# EAGLE design polarization_switch_mid_redo_top_rt (EAGLE 9.6.2)
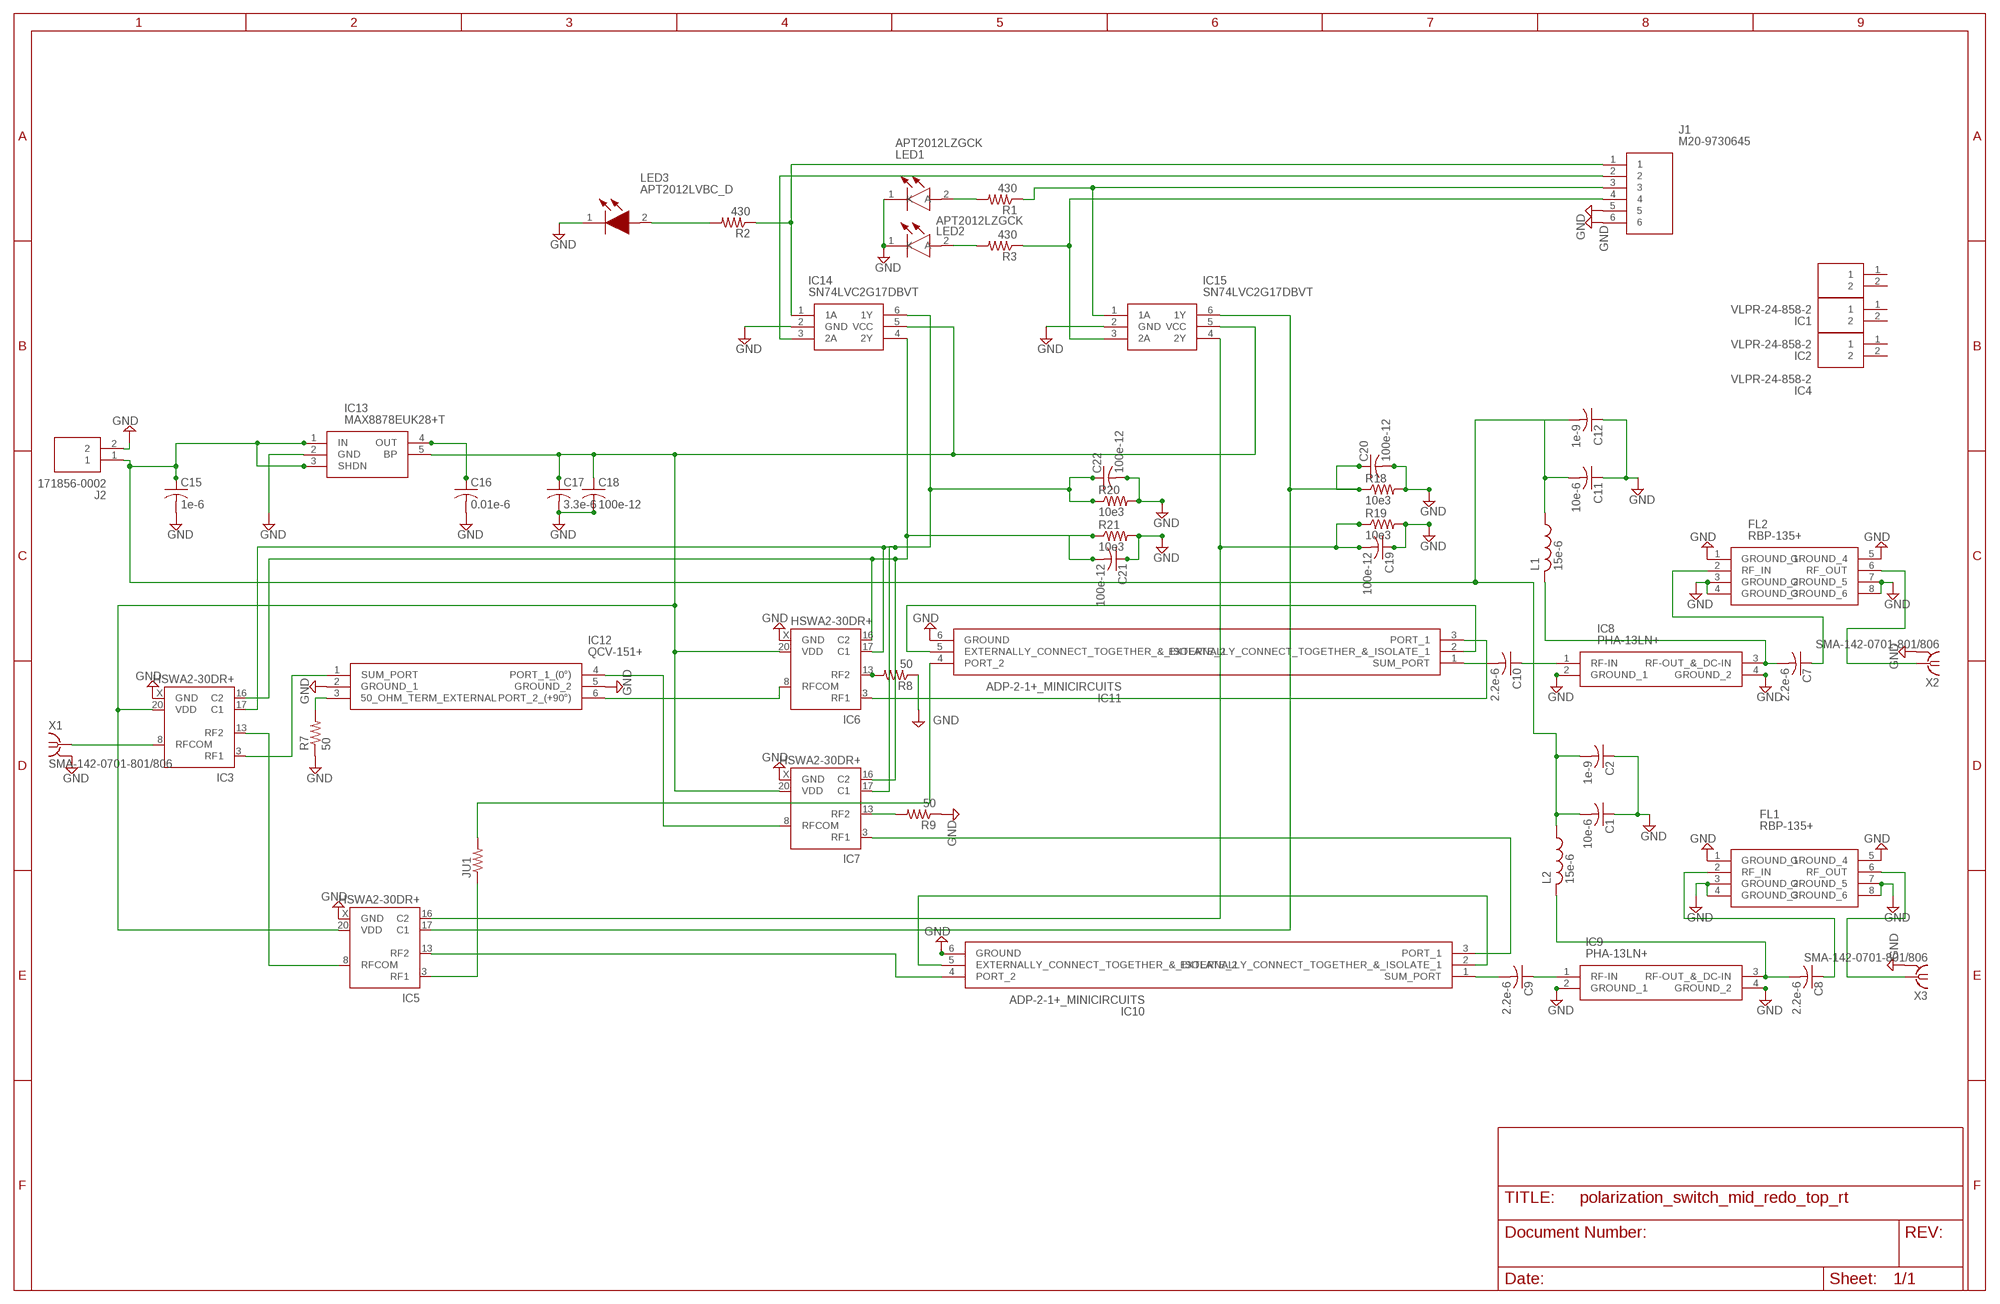
[diagram p0: schematic, sheet 1]

## Parts
C1  10e-6  C-USC0603  [C0603]
C2  1e-9  C-USC0603  [C0603]
C7  2.2e-6  C-USC0603  [C0603]
C8  2.2e-6  C-USC0603  [C0603]
C9  2.2e-6  C-USC0603  [C0603]
C10  2.2e-6  C-USC0603  [C0603]
C11  10e-6  C-USC0603  [C0603]
C12  1e-9  C-USC0603  [C0603]
C15  1e-6  C-USC0603  [C0603]
C16  0.01e-6  C-USC0603  [C0603]
C17  3.3e-6  C-USC0603  [C0603]
C18  100e-12  C-USC0603  [C0603]
C19  100e-12  C-USC0603  [C0603]
C20  100e-12  C-USC0603  [C0603]
C21  100e-12  C-USC0603  [C0603]
C22  100e-12  C-USC0603  [C0603]
FL1  RBP-135+  [RBP135]
FL2  RBP-135+  [RBP135]
IC1  VLPR-24-858-2  [VLPR248582]
IC2  VLPR-24-858-2  [VLPR248582]
IC3  HSWA2-30DR+  [DG983-1]
IC4  VLPR-24-858-2  [VLPR248582]
IC5  HSWA2-30DR+  [DG983-1]
IC6  HSWA2-30DR+  [DG983-1]
IC7  HSWA2-30DR+  [DG983-1]
IC8  PHA-13LN+  [PHA13LN]
IC9  PHA-13LN+  [PHA13LN]
IC10  ADP-2-1+_MINICIRCUITS  [SOTFL254P691X411-6N]
IC11  ADP-2-1+_MINICIRCUITS  [SOTFL254P691X411-6N]
IC12  QCV-151+  [QCV151]
IC13  MAX8878EUK28+T  [SOT95P280X145-5N]
IC14  SN74LVC2G17DBVT  [SOT95P280X145-6N]
IC15  SN74LVC2G17DBVT  [SOT95P280X145-6N]
J1  M20-9730645  [HDRV6W66P0X254_1X6_1524X254X96]
J2  171856-0002  [SHDR2W90P0X254_1X2_493X635X106]
JU1  R-US_R1206  [R1206]
L1  15e-6  L-USL3225M  [L3225M]
L2  15e-6  L-USL3225M  [L3225M]
LED1  APT2012LZGCK  [LEDC2012X85N]
LED2  APT2012LZGCK  [LEDC2012X85N]
LED3  APT2012LVBC_D  [LEDC2012X85N]
R1  430  R-US_R0603  [R0603]
R2  430  R-US_R0603  [R0603]
R3  430  R-US_R0603  [R0603]
R7  50  R-US_R0603  [R0603]
R8  50  R-US_R0603  [R0603]
R9  50  R-US_R0603  [R0603]
R18  10e3  R-US_R0603  [R0603]
R19  10e3  R-US_R0603  [R0603]
R20  10e3  R-US_R0603  [R0603]
R21  10e3  R-US_R0603  [R0603]
X1  SMA-142-0701-801/806  [J502-ND-142-0701-801/806]
X2  SMA-142-0701-801/806  [J502-ND-142-0701-801/806]
X3  SMA-142-0701-801/806  [J502-ND-142-0701-801/806]

## Nets
GND: C1.1 C2.1 C11.1 C12.1 C15.2 C16.2 C17.2 C18.2 C19.1 C20.2 C21.1 C22.2 FL1.1(GROUND_1) FL1.3(GROUND_2) FL1.4(GROUND_3) FL1.5(GROUND_4) FL1.7(GROUND_5) FL1.8(GROUND_6) FL2.1(GROUND_1) FL2.3(GROUND_2) FL2.4(GROUND_3) FL2.5(GROUND_4) FL2.7(GROUND_5) FL2.8(GROUND_6) IC3.X(GND) IC5.X(GND) IC6.X(GND) IC7.X(GND) IC8.2(GROUND_1) IC8.4(GROUND_2) IC9.2(GROUND_1) IC9.4(GROUND_2) IC10.6(GROUND) IC11.6(GROUND) IC12.2(GROUND_1) IC12.5(GROUND_2) IC13.2(GND) IC14.2(GND) IC15.2(GND) J1.5 J1.6 J2.2 LED1.1(K) LED2.1(K) LED3.1(K) R7.1 R8.1 R9.1 R18.2 R19.2 R20.2 R21.2 X1.G@1 X1.G@2 X1.G@3 X1.G@4 X2.G@1 X2.G@2 X2.G@3 X2.G@4 X3.G@1 X3.G@2 X3.G@3 X3.G@4
N$1: LED2.2(A) R3.2
N$2: LED1.2(A) R1.2
N$3: LED3.2(A) R2.2
N$4: IC5.13(RF2) IC10.4(PORT_2)
N$5: IC3.8(RFCOM) X1.1
N$6: C10.2 IC11.1(SUM_PORT)
N$7: IC7.3(RF1) IC10.3(PORT_1)
N$8: C20.1 IC5.17(C1) IC15.6(1Y) R18.1
N$9: IC7.8(RFCOM) IC12.4(PORT_1_(0°))
N$10: IC11.4(PORT_2) JU1.2
N$11: IC6.3(RF1) IC11.3(PORT_1)
N$12: IC5.3(RF1) JU1.1
N$13: C10.1 IC8.1(RF-IN)
N$14: IC3.3(RF1) IC12.1(SUM_PORT)
N$15: IC3.13(RF2) IC5.8(RFCOM)
N$16: IC6.8(RFCOM) IC12.6(PORT_2_(+90°))
N$19: IC6.13(RF2) R8.2
N$20: C7.2 IC8.3(RF-OUT_&_DC-IN) L1.2
N$21: C9.2 IC10.1(SUM_PORT)
N$22: IC11.2(EXTERNALLY_CONNECT_TOGETHER_&_ISOLATE_1) IC11.5(EXTERNALLY_CONNECT_TOGETHER_&_ISOLATE_2)
N$25: IC10.2(EXTERNALLY_CONNECT_TOGETHER_&_ISOLATE_1) IC10.5(EXTERNALLY_CONNECT_TOGETHER_&_ISOLATE_2)
N$26: C9.1 IC9.1(RF-IN)
N$27: C8.2 IC9.3(RF-OUT_&_DC-IN) L2.2
N$28: C7.1 FL2.2(RF_IN)
N$29: FL2.6(RF_OUT) X2.1
N$30: C8.1 FL1.2(RF_IN)
N$31: FL1.6(RF_OUT) X3.1
N$32: IC12.3(50_OHM_TERM_EXTERNAL) R7.2
N$35: IC7.13(RF2) R9.2
N$36: C1.2 C2.2 C11.2 C12.2 C15.1 IC13.1(IN) IC13.3(SHDN) J2.1 L1.1 L2.1
N$37: IC14.1(1A) J1.1 R2.1
N$38: C19.2 IC5.16(C2) IC15.4(2Y) R19.1
N$39: C17.1 C18.1 IC3.20(VDD) IC5.20(VDD) IC6.20(VDD) IC7.20(VDD) IC13.5(BP) IC14.5(VCC) IC15.5(VCC)
N$40: C16.1 IC13.4(OUT)
N$42: C22.1 IC3.17(C1) IC6.17(C1) IC7.17(C1) IC14.6(1Y) R20.1
N$43: IC14.3(2A) J1.2
N$44: IC15.1(1A) J1.3 R1.1
N$45: IC15.3(2A) J1.4 R3.1
N$46: C21.2 IC3.16(C2) IC6.16(C2) IC7.16(C2) IC14.4(2Y) R21.1
Unconnected: IC1.1 IC1.2 IC2.1 IC2.2 IC4.1 IC4.2

## Power pins joined to a net without a drawn wire
GND: IC3.1(GND) IC3.2(GND) IC3.4(GND) IC3.5(GND) IC3.6(GND) IC3.7(GND) IC3.9(GND) IC3.10(GND) IC3.11(GND) IC3.12(GND) IC3.14(GND) IC3.15(GND) IC3.18(GND) IC3.19(GND) IC5.1(GND) IC5.2(GND) IC5.4(GND) IC5.5(GND) IC5.6(GND) IC5.7(GND) IC5.9(GND) IC5.10(GND) IC5.11(GND) IC5.12(GND) IC5.14(GND) IC5.15(GND) IC5.18(GND) IC5.19(GND) IC6.1(GND) IC6.2(GND) IC6.4(GND) IC6.5(GND) IC6.6(GND) IC6.7(GND) IC6.9(GND) IC6.10(GND) IC6.11(GND) IC6.12(GND) IC6.14(GND) IC6.15(GND) IC6.18(GND) IC6.19(GND) IC7.1(GND) IC7.2(GND) IC7.4(GND) IC7.5(GND) IC7.6(GND) IC7.7(GND) IC7.9(GND) IC7.10(GND) IC7.11(GND) IC7.12(GND) IC7.14(GND) IC7.15(GND) IC7.18(GND) IC7.19(GND)

## Library data of the parts
C1 C2 C7-C12 C15-C22 = rcl:C-US: CAPACITOR, American symbol; SPICEPREFIX: C
FL1 FL2 = RBP-135+:RBP-135+: Metal Shield Bandpass Filter Source: Datasheet <https://www.minicircuits.com/pdfs/RBP-135 .pdf>; DESCRIPTION: Metal Shield Bandpass Filter; HEIGHT: 2.54mm; MANUFACTURER_NAME: Mini-Circuits; MANUFACTURER_PART_NUMBER: RBP-135+
IC1 IC2 IC4 = VLPR-24-858-2:VLPR-24-858-2: LED Light Pipes Light Pipe Vert SMD Rect Face Source: Datasheet <http://uk.rs-online.com/web/p/products/9063748>; DESCRIPTION: LED Light Pipes Light Pipe Vert SMD Rect Face; HEIGHT: 21mm; MANUFACTURER_NAME: Bivar; MANUFACTURER_PART_NUMBER: VLPR-24-858-2; RS_PART_NUMBER: 9063748; RS_PRICE-STOCK: http://uk.rs-online.com/web/p/products/9063748
IC3 IC5-IC7 = minicircuits:HSWA2-30DR+: SPDT RF SWITCH Absorptive RF Switch with internal driver Source: http://www.minicircuits.com .. HSWA2-30DR+.pdf; OC_FARNELL: unknown; OC_NEWARK: unknown
IC8 IC9 = PHA-13LN+:PHA-13LN+: ic Source: Datasheet <https://www.minicircuits.com/pdfs/PHA-13LN .pdf>; DESCRIPTION: ic; HEIGHT: 1.6mm; MANUFACTURER_NAME: Mini Circuits; MANUFACTURER_PART_NUMBER: PHA-13LN+
IC10 IC11 = ADP-2-1+_MINICIRCUITS:ADP-2-1+_MINICIRCUITS: Power Splitter/Combiner Source: Datasheet <https://www.minicircuits.com/pdfs/ADP-2-1 .pdf>; DESCRIPTION: Power Splitter/Combiner; HEIGHT: 4.11mm; MANUFACTURER_NAME: Mini-Circuits; MANUFACTURER_PART_NUMBER: ADP-2-1+ MINICIRCUITS
IC12 = QCV-151+:QCV-151+: 2 Way-90 Power Splitter Source: Datasheet <https://www.minicircuits.com/pdfs/QCV-151 .pdf>; DESCRIPTION: 2 Way-90 Power Splitter; HEIGHT: 1.652mm; MANUFACTURER_NAME: Mini-Circuits; MANUFACTURER_PART_NUMBER: QCV-151+
IC13 = MAX8878EUK28+T:MAX8878EUK28+T: LDO Voltage Regulators Low-Noise, Low-Dropout, 150mA Linear Regulators with 2982 Pinout Source: Datasheet <https://www.mouser.com/datasheet/2/256/MAX8878-1389229.pdf>; DESCRIPTION: LDO Voltage Regulators Low-Noise, Low-Dropout, 150mA Linear Regulators with 2982 Pinout; HEIGHT: 1.45mm; MANUFACTURER_NAME: Maxim Integrated; MANUFACTURER_PART_NUMBER: MAX8878EUK28+T
IC14 IC15 = SN74LVC2G17DBVT:SN74LVC2G17DBVT: DUAL SCHMITT-TRIGGER BUFFER Source: Datasheet <http://www.ti.com/lit/gpn/SN74LVC2G17>; DESCRIPTION: DUAL SCHMITT-TRIGGER BUFFER; HEIGHT: 1.45mm; MANUFACTURER_NAME: Texas Instruments; MANUFACTURER_PART_NUMBER: SN74LVC2G17DBVT; MOUSER_PART_NUMBER: 595-SN74LVC2G17DBVT; MOUSER_PRICE-STOCK: https://www.mouser.com/Search/Refine.aspx?Keyword=595-SN74LVC2G17DBVT; RS_PART_NUMBER: 6628944P; RS_PRICE-STOCK: http://uk.rs-online.com/web/p/products/6628944P
J1 = M20-9730645:M20-9730645: Headers & Wire Housings 06 SIL VERTICAL PIN HEADER GOLD HT Source: Datasheet <https://cdn.harwin.com/pdfs/C001XX_M20_Series_Connectors.pdf>; DESCRIPTION: Headers & Wire Housings 06 SIL VERTICAL PIN HEADER GOLD HT; HEIGHT: 9.64mm; MANUFACTURER_NAME: HARWIN; MANUFACTURER_PART_NUMBER: M20-9730645; MOUSER_PART_NUMBER: 855-M20-9730645; MOUSER_PRICE-STOCK: https://www.mouser.com/Search/Refine.aspx?Keyword=855-M20-9730645
J2 = 171856-0002:171856-0002: KK 254 RPC Pin Header friction lock 2way Molex KK 254 Series, Series Number 171856, 2.54mm Pitch 2 Way 1 Row Straight PCB Header, Through Hole Source: Datasheet <https://www.digikey.com/product-detail/en/molex/1718560002/WM10153-ND/4423109>; ALLIED_NUMBER: 70314268; ALLIED_PRICE-STOCK: https://www.alliedelec.com/molexincorporated-171856-0002/70314268/; DESCRIPTION: KK 254 RPC Pin Header friction lock 2way Molex KK 254 Series, Series Number 171856, 2.54mm Pitch 2 Way 1 Row Straight PCB Header, Through Hole; HEIGHT: 10.61mm; MANUFACTURER_NAME: Molex; MANUFACTURER_PART_NUMBER: 171856-0002; MOUSER_PART_NUMBER: 538-171856-0002; MOUSER_PRICE-STOCK: https://www.mouser.com/Search/Refine.aspx?Keyword=538-171856-0002; RS_PART_NUMBER: 7922884P; RS_PRICE-STOCK: http://uk.rs-online.com/web/p/products/7922884P
JU1 = rcl_jumper_pads:R-US_: RESISTOR, American symbol; SPICEPREFIX: R
L1 L2 = rcl:L-US: INDUCTOR, American symbol; SPICEPREFIX: L
LED1 LED2 = APT2012LZGCK:APT2012LZGCK: Standard LEDs - SMD 2.0X1.2MM LOW CRNT Source: Datasheet <http://www.kingbrightusa.com/images/catalog/SPEC/APT2012LZGCK.pdf>; ALLIED_NUMBER: 71056205; ALLIED_PRICE-STOCK: https://www.alliedelec.com/kingbright-apt2012lzgck/71056205/; DESCRIPTION: Standard LEDs - SMD 2.0X1.2MM LOW CRNT; HEIGHT: 0.85mm; MANUFACTURER_NAME: Kingbright; MANUFACTURER_PART_NUMBER: APT2012LZGCK; MOUSER_PART_NUMBER: 604-APT2012LZGCK; MOUSER_PRICE-STOCK: https://www.mouser.com/Search/Refine.aspx?Keyword=604-APT2012LZGCK
LED3 = APT2012LVBC_D:APT2012LVBC_D: Standard LEDs - SMD 2.0X1.2MM LOW CRNT Source: Datasheet <https://componentsearchengine.com/Datasheets/1/APT2012LVBC_D.pdf>; ARROW_PART_NUMBER: APT2012LVBC/D; ARROW_PRICE-STOCK: https://www.arrow.com/en/products/apt2012lvbcd/kingbright; DESCRIPTION: Standard LEDs - SMD 2.0X1.2MM LOW CRNT; HEIGHT: 0.85mm; MANUFACTURER_NAME: Kingbright; MANUFACTURER_PART_NUMBER: APT2012LVBC/D; MOUSER_PART_NUMBER: 604-APT2012LVBCD; MOUSER_PRICE-STOCK: https://www.mouser.co.uk/ProductDetail/Kingbright/APT2012LVBC-D?qs=6oMev5NRZMGErJYT6KZLXg%3D%3D
R1-R3 R7-R9 R18-R21 = rcl:R-US_: RESISTOR, American symbol; SPICEPREFIX: R
X1-X3 = sma-flange_375mils:SMA-: SMA 50 Ohm End Launch Jack Receptacle - Round Contact Johnson Components Source: www.johnsoncomponents.com .. J502-ND.pdf; MF: JOHNSON COMPONENTS; MPN: 142-0701-801; OC_FARNELL: 1608592; OC_NEWARK: 90F2624

## Board
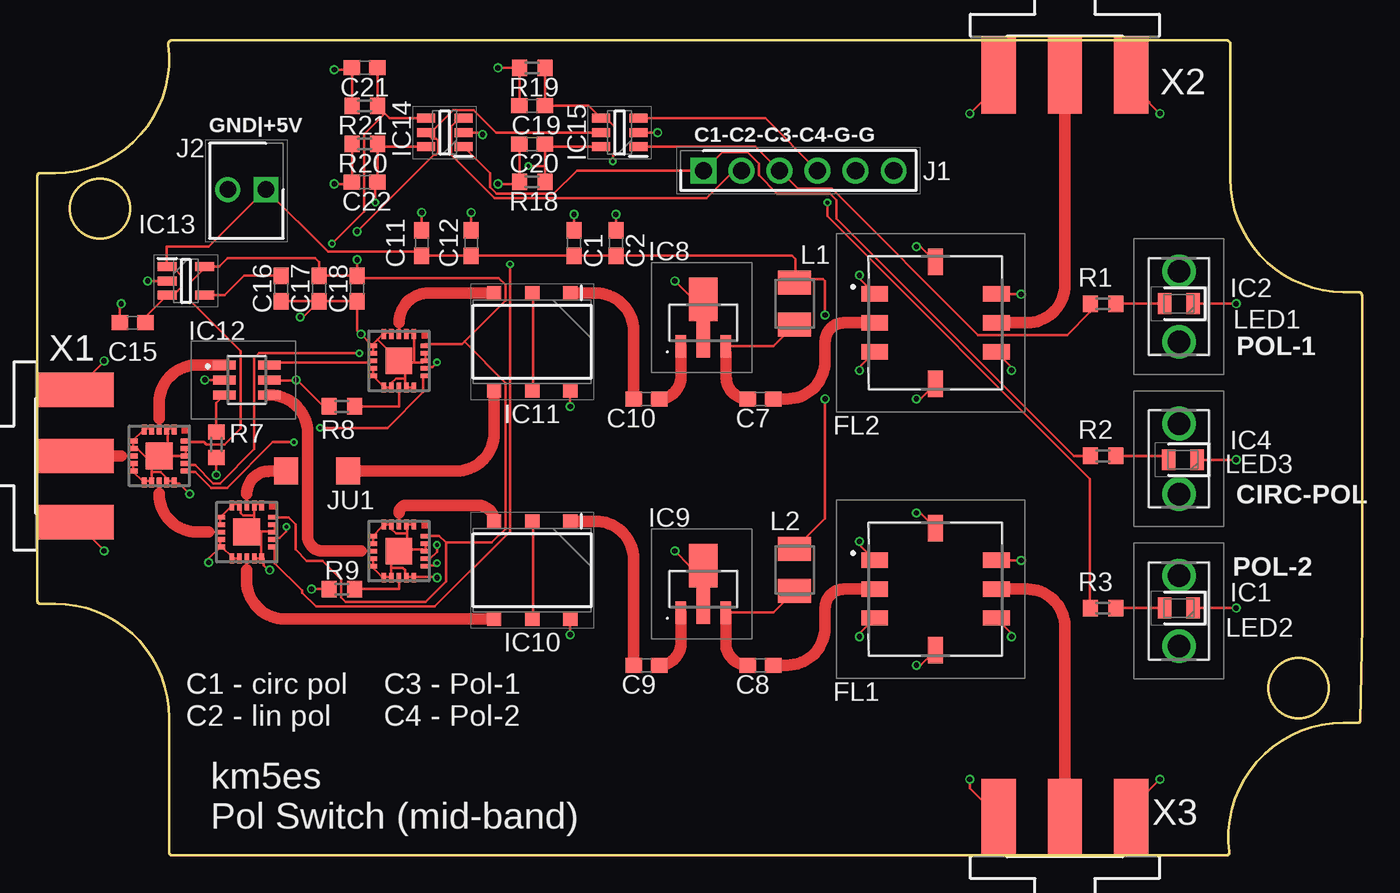
[diagram p1: board, top side]
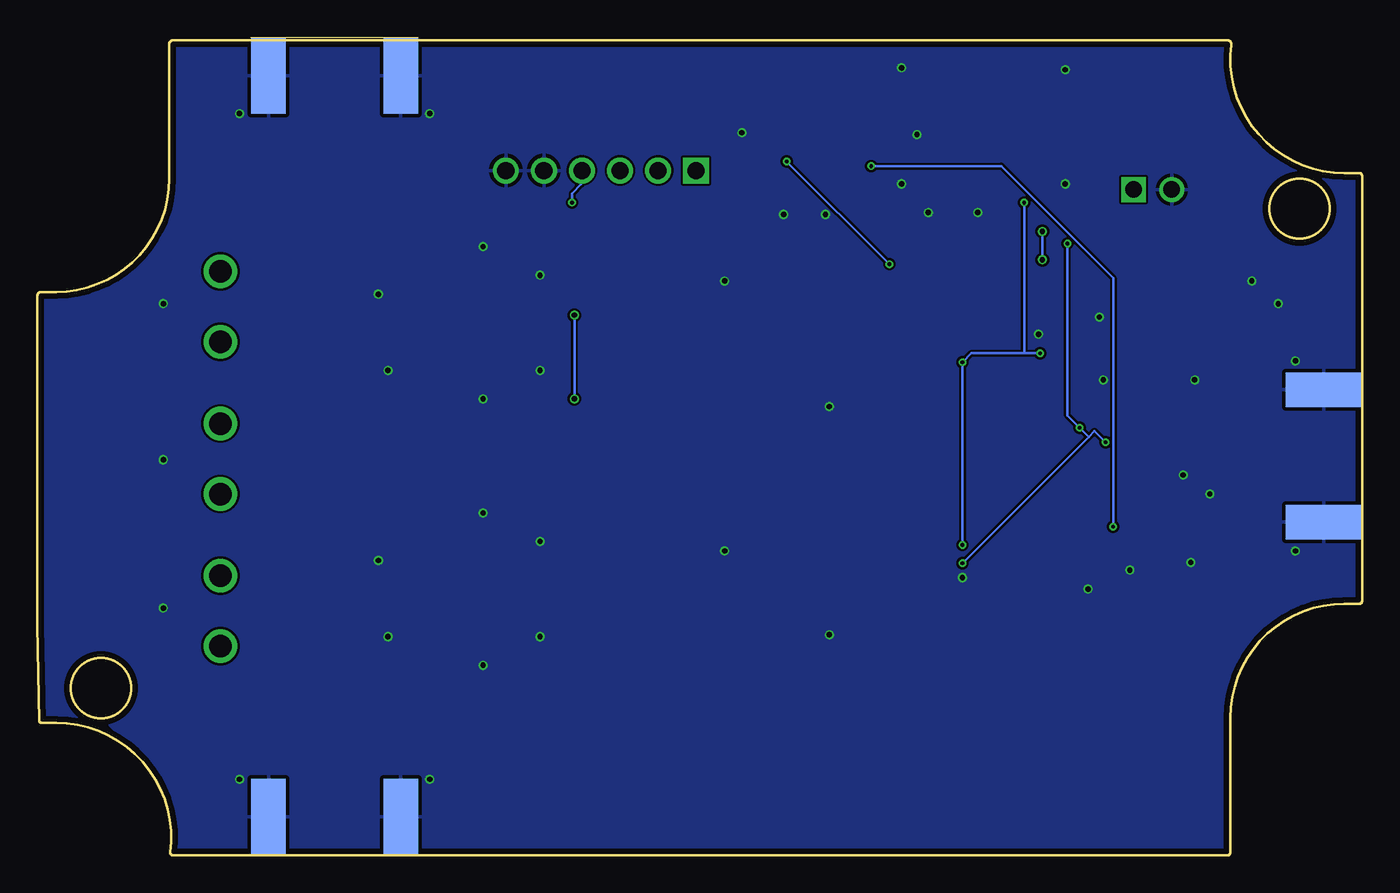
[diagram p2: board, bottom side, seen from below]

Size 88.42 x 54.42 mm. Coordinates in mm from the lower left corner, seen from the top.
Outline: 1.18,45.55 0.18,45.55 arc90 0,45.38 0,16.98 arc90 0.18,16.8 1.18,16.8 arc-90 8.8,9.18 8.8,0.18 arc90 8.98,0 79.38,0 arc97 79.55,0.2 arc-97 87.18,8.86 88.18,8.86 arc89 88.29,8.97 88.42,15.34 88.42,37.38 arc90 88.18,37.62 87.18,37.62 arc-90 79.62,45.18 79.62,54.18 arc90 79.38,54.42 8.98,54.42 arc99 8.74,54.14 arc-97 1.18,45.55
Outline: circle at 84.18,11.18 radius 2
Outline: circle at 4.18,43.18 radius 2
Copper layers (1*16): Top 0.035559375mm / dielectric 1.6mm / Bottom 0.035559375mm
Design rules "oshpark-2layer": minimum track width 6mil, minimum drill 10mil, track to track 6mil, track to pad 6mil, pad to pad 6mil, via to via 6mil, smd to smd 6mil, copper to edge 15mil, drill to drill 6mil, minimum pad ring 5mil, minimum via ring 5mil, stop-mask expansion 2.5mil, vias tented up to drill 0mil, thermal gap 10mil

### Footprints (pad centres in the part's own frame; a part is rotated, then mirrored left to right if it is on the bottom)
C0603 = smd 1.1 x 1: 1 -0.85,0; 2 0.85,0
RBP135 = smd 1.02 x 1.78: 1 -1.93,-4.065; 2 0,-4.065; 3 1.93,-4.065; 5 1.93,4.065; 6 0,4.065; 7 -1.93,4.065 | smd 1.78 x 1.02: 4 4.065,0; 8 -4.065,0
VLPR248582 = drill 1.5 pad 2.25: 1 0,0; 2 0,4.7
DG983-1 = smd 0.66 x 0.31: 1 -1.775,1; 2 -1.775,0.5; 3 -1.775,0; 4 -1.775,-0.5; 5 -1.775,-1; 11 1.775,-1; 12 1.775,-0.5; 13 1.775,0; 14 1.775,0.5; 15 1.775,1 | smd 0.31 x 0.66: 6 -1,-1.775; 7 -0.5,-1.775; 8 0,-1.775; 9 0.5,-1.775; 10 1,-1.775; 16 1,1.775; 17 0.5,1.775; 18 0,1.775; 19 -0.5,1.775; 20 -1,1.775 | smd 1.78 x 1.78: X 0,0
PHA13LN = smd 0.71 x 1.5: 1 -1.5,-1.56; 3 1.5,-1.56 | smd 0.91 x 2.5: 2 0,-1.06 | smd 1.91 x 2.92: 4 0,1.56
SOTFL254P691X411-6N = smd 0.935 x 0.96: 1 -3.262,2.54; 2 -3.262,0; 3 -3.262,-2.54; 4 3.262,-2.54; 5 3.262,0; 6 3.262,2.54
QCV151 = smd 0.6 x 1.5: 1 1,1.5; 2 0,1.5; 3 -1,1.5; 4 -1,-1.5; 5 0,-1.5; 6 1,-1.5
SOT95P280X145-5N = smd 1.25 x 0.6: 1 -1.25,0.95; 2 -1.25,0; 3 -1.25,-0.95; 4 1.25,-0.95; 5 1.25,0.95
SOT95P280X145-6N = smd 1.2 x 0.6: 1 -1.25,0.95; 2 -1.25,0; 3 -1.25,-0.95; 4 1.25,-0.95; 5 1.25,0; 6 1.25,0.95
HDRV6W66P0X254_1X6_1524X254X96 = drill 1.15 pad 1.725 square: 1 0,0 | drill 1.15 pad 1.725: 2 2.54,0; 3 5.08,0; 4 7.62,0; 5 10.16,0; 6 12.7,0
SHDR2W90P0X254_1X2_493X635X106 = drill 1.1 pad 1.65 square: 1 0,0 | drill 1.1 pad 1.65: 2 2.54,0
R1206 = smd 1.6 x 1.803: 1 -1.422,0; 2 2.692,0
L3225M = smd 1.6 x 2.2: 1 -1.4,0; 2 1.4,0
LEDC2012X85N = smd 0.9 x 1.4: 1 -0.95,0; 2 0.95,0
R0603 = smd 1 x 1.1: 1 -0.85,0; 2 0.85,0
J502-ND-142-0701-801/806 = smd 5.08 x 2.286: 1 2.565,0; G@1 2.565,4.42; G@2 2.565,-4.42 | smd 5.08 x 2.286 bottom: G@3 2.565,4.42; G@4 2.565,-4.42

### Placement (x,y rotation side)
C1  35.81,40.89 270 top
C2  38.61,40.89 270 top
C7  48.26,30.48 180 top
C8  48.26,12.7 180 top
C9  40.64,12.7 180 top
C10  40.64,30.48 180 top
C11  25.65,40.89 270 top
C12  28.96,40.89 270 top
C15  6.35,35.56 180 top
C16  16.26,37.85 270 top
C17  18.8,37.85 270 top
C18  21.34,37.85 270 top
C19  33.02,50.04 0 top
C20  33.02,47.5 180 top
C21  21.84,52.58 0 top
C22  21.84,44.96 180 top
FL1  59.94,17.78 270 top
FL2  59.94,35.56 270 top
IC1  76.2,13.97 0 top
IC2  76.2,34.29 0 top
IC3  8.13,26.67 270 top
IC4  76.2,24.13 0 top
IC5  13.97,21.59 270 top
IC6  24.13,33.02 270 top
IC7  24.13,20.32 270 top
IC8  44.45,35.56 0 top
IC9  44.45,17.78 0 top
IC10  33.02,19.05 270 top
IC11  33.02,34.29 270 top
IC12  13.97,31.75 90 top
IC13  9.91,38.35 0 top
IC14  27.18,48.26 180 top
IC15  38.86,48.26 180 top
J1  44.45,45.72 0 top
J2  15.24,44.45 180 top
JU1  18.03,25.65 0 top
L1  50.55,36.83 270 top
L2  50.55,19.05 270 top
LED1  76.2,36.83 180 top
LED2  76.2,16.51 180 top
LED3  76.45,26.42 180 top
R1  71.12,36.83 0 top
R2  71.12,26.67 0 top
R3  71.12,16.51 0 top
R7  11.94,27.43 90 top
R8  20.32,29.97 0 top
R9  20.32,17.78 0 top
R18  33.02,44.96 180 top
R19  33.02,52.58 180 top
R20  21.84,47.5 180 top
R21  21.84,50.04 180 top
X1  0,26.67 0 top
X2  68.58,54.61 270 top
X3  68.58,0 90 top

### Tracks (layer width: path | path; a pad name or v marks a point on that pad's centre or on a via)
GND  (via drill 0.35)
  Top 0.152: C15.2 5.5,36.74 v5.59,36.83 | C16.2 C17.2 | v17.53,35.94 17.74,35.94 C17.2 | C17.2 C18.2 21.34,35.05 v21.59,34.8 22.25,34.14 IC6.6 | IC13.2 v7.37,38.35 | R7.1 v11.94,25.4 | v18.29,17.78 R9.1 | IC12.2 v11.18,31.75 | C21.1 20.91,52.49 | 20.91,52.49 20.87,52.45 v19.81,52.45 | R21.2 20.99,52.41 20.91,52.49 | R20.2 C22.2 20.87,44.83 v19.81,44.83 | C19.1 R19.2 v30.73,52.58 | C20.2 R18.2 32.04,44.83 v30.73,44.83 | IC14.2 29.59,48.26 v29.72,48.13 | IC15.2 v41.4,48.26 | C11.1 v25.65,42.93 | C12.1 v28.96,42.93 | LED3.1 v80.01,26.42 | LED1.1 v80.01,36.83 | LED2.1 v80.01,16.51 | FL2.1 54.86,38.51 v54.86,38.73 | FL2.8 58.93,40.64 v58.67,40.64 | FL2.7 65.63,37.49 v65.66,37.47 | FL2.5 65.02,32.62 v65.02,32.38 | FL2.4 58.93,30.48 v58.67,30.48 | FL2.3 54.86,32.62 v54.86,32.38 | FL1.1 54.86,20.73 v54.86,20.95 | FL1.8 58.93,22.86 v58.67,22.86 | FL1.7 65.63,19.71 v65.66,19.68 | FL1.5 65.02,14.84 v65.02,14.61 | FL1.4 58.93,12.7 v58.67,12.7 | FL1.3 54.86,14.84 v54.86,14.61 | v42.55,38.35 43.78,37.12 IC8.4 44.5,37.03 44.5,34.59 IC8.2 | v42.55,20.32 43.52,19.34 IC9.4 44.5,19.2 44.5,16.76 IC9.2 | X1.G@1 4.45,32.97 v4.45,33.02 | X1.G@4 4.45,20.37 v4.45,20.32 | v62.23,49.53 63.5,50.8 63.55,50.75 64.16,51.36 X2.G@4 | v74.93,49.53 74.19,50.27 74.22,50.29 73,51.51 X2.G@1 | v74.93,5.08 73.41,3.56 73.46,3.5 73,3.05 X3.G@4 | v35.56,29.97 IC11.6 | v35.56,14.73 IC10.6 | C1.1 v35.81,42.8 | C2.1 v38.61,42.8 | IC6.9 22.4,32.46 22.4,32.16 IC6.10 22.4,32 23.01,31.39 IC6.11 23.16,31.24 IC6.12 23.62,31.39 23.62,31.55 23.93,31.85 24.54,31.85 | IC6.2 24.69,34.9 24.99,34.9 IC6.1 25.15,34.75 25.15,32.92 | IC6.19 25.91,33.38 25.91,33.07 IC6.18 25.76,32.92 25.15,32.92
  Top 0.152: IC6.15 24.99,31.24 24.69,31.24 IC6.14 24.54,31.39 24.54,31.85 | 24.54,32.61 24.54,31.85 | IC6.X 24.54,32.61 | 25.15,32.92 24.84,32.92 24.54,32.61 | 24.23,32.92 IC6.X | IC7.7 22.4,20.88 22.4,21.18 IC7.6 22.4,21.34 23.01,21.95 IC7.5 23.16,22.1 IC7.4 23.62,21.95 23.62,21.79 23.93,21.49 24.69,21.49 | 23.62,18.59 23.16,18.59 IC7.11 23.01,18.59 22.4,19.2 IC7.10 22.4,19.36 22.4,19.81 IC7.9 | IC7.1 24.99,22.1 24.69,22.1 IC7.2 24.69,21.95 24.69,21.49 | IC7.19 25.91,20.73 25.91,20.42 IC7.18 25.76,20.42 24.69,20.42 | 24.69,20.42 24.23,20.42 IC7.X | 24.69,20.42 24.69,21.49 | 24.69,20.42 IC7.X | 23.62,19.2 23.62,19.81 IC7.X | 23.62,19.2 23.62,18.59 | 23.62,18.59 IC7.12 | IC3.4 7.62,28.5 7.16,28.5 IC3.5 7.01,28.35 6.4,27.74 IC3.6 6.4,27.58 6.4,27.28 IC3.7 6.4,27.13 6.71,27.13 7.62,26.21 | 7.62,24.99 7.16,24.99 IC3.11 7.01,24.99 6.4,25.6 IC3.10 6.4,25.76 6.4,26.06 IC3.9 | IC3.1 8.99,28.5 8.69,28.5 IC3.2 8.69,28.35 8.69,26.67 | IC3.19 9.91,27.13 IC3.18 8.69,26.67 | IC3.X 8.69,26.67 | 8.23,26.67 IC3.X | 7.62,26.21 7.62,25.6 | 7.62,25.6 7.62,24.99 | 7.62,26.21 8.08,26.67 IC3.X | 7.62,24.99 IC3.12 | 7.62,26.21 IC3.X | IC5.7 12.19,22.55 IC5.6 12.34,22.71 12.95,23.32 IC5.5 13.11,23.47 13.41,23.47 IC5.4 13.56,23.32 13.56,22.86 13.72,22.71 14.48,22.71 | IC5.1 14.94,23.47 14.48,23.47 IC5.2 14.48,23.32 14.48,22.71 | IC5.19 15.85,21.95 15.85,21.64 IC5.18 15.7,21.64 14.94,21.64 | 14.48,21.64 14.02,21.64 IC5.X 14.48,21.64 | 14.48,21.64 14.94,21.64 | 14.48,21.64 14.48,22.71 | IC6.7 22.4,33.53 22.4,33.98 IC6.6 | IC6.4 23.62,34.9 23.16,34.9 IC6.5 23.01,34.75 22.71,34.44 | 22.71,34.44 22.4,34.14 IC6.6 | IC5.12 13.41,19.81 13.11,19.81 IC5.11 12.95,19.96 12.34,20.57 IC5.10
  Top 0.152: IC5.10 12.19,20.73 12.19,21.03 IC5.9 | 8.84,24.99 8.99,24.99 IC3.15 9.14,24.84 9.45,24.84 v10.16,24.13 | 8.84,24.99 8.69,24.99 IC3.14 | IC5.14 14.94,19.81 IC5.15 | IC5.15 15.09,19.81 15.09,19.36 15.39,19.05 v15.49,19.05 | v26.67,18.54 26.67,18.59 25.15,18.59 IC7.15 24.99,18.59 24.69,18.59 IC7.14 24.54,18.59 24.54,19.05 24.38,19.2 23.62,19.2 | R8.1 19.36,30.02 19.05,30.02 17.37,31.7 v17.27,31.75 17.22,31.7 15.54,31.7 IC12.5 | v11.43,19.56 11.43,19.81 12.19,20.57 IC5.10 | 14.94,21.64 14.94,19.96 IC5.15 | 7.62,25.6 8.23,25.6 8.84,24.99 | 22.71,34.44 IC6.X | 64.16,3.35 X3.G@1 62.23,4.5 v62.23,5.08
  pour Bottom: 0,16.51 8.89,7.62 8.89,0 80.01,0 81.28,1.27 81.28,6.35 83.82,8.89 88.9,8.89 88.9,38.1 85.09,38.1 80.01,43.18 80.01,54.61 8.89,54.61 7.62,53.34 5.08,50.8 5.08,46.99 3.81,45.72 0,45.72
N$1
  Top 0.152: R3.2 LED2.2
N$2
  Top 0.152: R1.2 LED1.2
N$3
  Top 0.152: R2.2 75.25,26.67 LED3.2
N$4
  Top 0.152: 13.97,19.05 IC5.13
  Top 0.762: 13.97,19.05 13.97,18.33 arc90 16.51,15.79 IC10.4
N$5
  Top 0.152: 5.59,26.67 IC3.8
  Top 0.762: X1.1 5.59,26.67
N$6
  Top 0.762: IC11.1 37.25,37.55 arc-90 39.79,35.01 C10.2
N$7
  Top 0.152: 24.13,22.86 IC7.3
  Top 0.762: IC10.3 arc90 29.42,23.37 24.64,23.37 arc90 24.13,22.86
N$8  (via drill 0.25)
  Top 0.152: IC15.6 34.06,47.31 | 34.06,47.31 C20.1 | R18.1 33.87,46.02 | 33.87,46.02 33.87,47.12 34.06,47.31 | v16.61,21.95 16.61,21.64 16.15,21.18 15.85,21.18 IC5.17 | 33.87,46.02 v32.77,46.02
  Bottom 0.152: v16.61,21.95 16.61,38.56 24.08,46.02 v32.77,46.02
N$9
  Top 0.152: 21.59,20.32 IC7.8
  Top 0.762: IC12.4 15.49,30.75 arc-90 18.03,28.21 18.03,21.34 arc90 19.05,20.32 21.59,20.32
N$10
  Top 0.762: IC11.4 30.48,28.19 arc-90 27.94,25.65 JU1.2
N$11
  Top 0.152: 24.13,35.56 IC6.3
  Top 0.762: IC11.3 26.12,37.55 arc90 24.13,35.56
N$12
  Top 0.152: IC5.3 13.97,24.13
  Top 0.762: JU1.1 15.49,25.65 arc90 13.97,24.13
N$13
  Top 0.762: C10.1 arc90 42.95,31.94 IC8.1
N$14
  Top 0.152: 8.13,29.18 IC3.3
  Top 0.762: 8.13,29.18 8.13,30.21 arc-90 10.67,32.75 IC12.1
N$15
  Top 0.152: IC3.13 8.13,24.16 | 11.43,21.59 IC5.8
  Top 0.762: 8.13,24.16 8.13,24.13 arc90 10.67,21.59 11.43,21.59
N$16
  Top 0.152: IC6.8 22.25,32.92 15.7,32.92 15.54,32.77 IC12.6
N$19
  Top 0.152: IC6.13 24.13,29.97 R8.2
N$20
  Top 0.152: L1.2 49.12,34 IC8.3 46.02,33.98 46.02,33.83 45.97,33.53
  Top 0.762: C7.2 arc-90 45.97,31.92 45.97,33.53
N$21
  Top 0.762: IC10.1 37.25,22.31 arc-90 39.79,19.77 C9.2
N$22
  Top 0.152: IC11.5 33.07,31.09 33.07,37.49 IC11.2
N$25
  Top 0.152: IC10.5 33.07,15.85 33.07,22.25 IC10.2
N$26
  Top 0.762: IC9.1 42.95,14.16 arc-90 C9.1
N$27
  Top 0.152: L2.2 49.12,16.22 IC9.3
  Top 0.762: IC9.3 45.95,14.16 arc90 C8.2
N$28
  Top 0.762: C7.1 50.04,30.48 arc90 52.58,33.02 52.58,34.29 arc-90 53.85,35.56 FL2.2
N$29
  Top 0.762: FL2.6 66.04,35.56 arc90 68.58,38.1 X2.1
N$30
  Top 0.762: C8.1 50.04,12.7 arc90 52.58,15.24 52.58,16.51 arc-90 53.85,17.78 FL1.2
N$31
  Top 0.152: X3.1 68.58,2.59 68.33,2.59
  Top 0.762: 68.33,2.59 68.33,3.05 68.58,3.3 68.58,15.24 arc90 66.04,17.78 FL1.6
N$32
  Top 0.152: IC12.3 11.94,30.22 R7.2
N$35
  Top 0.152: IC7.13 24.13,17.78 R9.2
N$36  (via drill 0.35)
  Top 0.152: C15.1 7.2,35.95 IC13.3 8.69,37.49 9.14,37.49 9.6,37.95 9.6,38.71 9.14,39.17 8.69,39.17 IC13.1 8.64,39.32 8.64,40.64 11.43,40.64 J2.1 19.39,40.3 25.4,40.3 C11.2 C12.2 C1.2 C2.2 50.38,40.04 50.61,39.82 50.61,38.29 | 50.61,38.29 50.8,38.48 52.45,38.48 52.58,38.35 v52.58,36.07 | 50.61,38.29 L1.1 | L2.1 52.58,22.48 v52.58,30.48
  Bottom 0.152: v52.58,30.48 v52.58,36.07
N$37
  Top 0.152: IC14.1 30.2,45.53 30.2,44.61 30.64,44.18 34.47,44.18 36.01,45.72 J1.1 44.5,45.72 45.72,46.94 47.4,46.94 48.16,46.18 48.16,45.41 49.38,44.2 52.88,44.2 53.34,43.74 53.34,42.52 69.19,26.67 R2.1
N$38  (via drill 0.25)
  Top 0.152: R19.1 C19.2 36.78,50.04 IC15.4 37.64,49.07 38.1,49.07 38.56,48.62 38.56,46.94 38.41,46.79 v38.41,46.33 | v31.55,39.47 31.55,21.64 26.52,16.61 18.59,16.61 17.68,17.53 17.68,17.68 15.85,19.51 15.85,20.57 IC5.16
  Bottom 0.152: v38.41,46.33 v31.55,39.47
N$39  (via drill 0.35)
  Top 0.152: C18.1 C17.1 18.8,39.62 18.54,39.88 12.7,39.88 12.13,39.3 IC13.5 11.12,39.17 10.21,38.25 10.21,37.03 13.56,33.68 13.56,28.5 12.5,27.43 11.28,27.43 11.12,27.58 9.91,27.58 IC3.20 | IC15.5 30.6,48.26 29.12,49.74 27.73,49.74 26.25,48.26 IC14.5 26.35,47.84 26.62,47.84 26.76,47.7 26.76,46.91 26.62,46.78 26.46,46.78 v21.34,41.66 | v21.34,39.77 C18.1 | 27.28,20.88 26.82,21.34 25.91,21.34 IC7.20 | 27.28,20.88 27.28,18.29 25.91,16.92 20.57,16.92 20.27,17.22 20.27,18.44 19.05,19.66 17.98,19.66 17.22,20.42 17.22,22.1 16.76,22.55 15.85,22.55 IC5.20 | 28.5,34.29 31.24,37.03 31.24,38.1 30.79,38.56 21.34,38.56 C18.1 | 28.5,34.29 28.35,34.14 25.91,34.14 IC6.20 | 27.28,20.88 30.33,20.88 31.24,21.79 31.24,31.55 28.5,34.29
  Bottom 0.152: v21.34,41.66 v21.34,39.77
N$40
  Top 0.152: IC13.4 12.51,37.4 13.8,38.7 C16.1
N$42  (via drill 0.25)
  Top 0.152: IC14.6 22.88,47.31 R20.1 C22.1 22.55,44.96 v22.55,43.59 | v21.49,33.53 14.78,33.53 14.48,33.22 14.48,27.13 12.19,24.84 11.73,24.84 10.52,26.06 9.91,26.06 IC3.17 | v26.67,32.92 26.36,32.61 25.91,32.61 IC6.17 | v26.67,20.73 26.67,20.27 26.21,19.81 IC7.17
  Bottom 0.152: 22.55,33.53 26.06,33.53 v26.67,32.92 v26.67,20.73 | 22.55,33.53 v21.49,33.53 | 22.55,33.53 v22.55,43.59
N$43
  Top 0.152: J1.2 46.5,45.72 44.65,43.88 30.51,43.88 27.6,46.78 27.6,48.66 27.94,48.99 27.94,49.02 27.89,49.07 28.35,49.07 IC14.3
N$44
  Top 0.152: IC15.1 47.94,47.31 J1.3 50.75,44.5 53.03,44.5 62.79,34.75 68.73,34.75 70.26,36.27 70.26,36.73 R1.1
N$45  (via drill 0.25)
  Top 0.152: J1.4 48.58,49.21 IC15.3 | v52.73,43.59 52.73,42.67 70.26,25.15 70.26,16.61 R3.1
  Bottom 0.152: v52.73,43.59 52.73,44.2 52.12,44.81 52.12,45.72 J1.4
N$46  (via drill 0.25)
  Top 0.152: IC14.4 23.52,49.21 R21.1 | C21.2 R21.1 | v17.12,27.58 15.7,27.58 12.65,24.54 11.58,24.54 10.52,25.6 9.91,25.6 IC3.16 | v18.85,28.55 23.37,28.55 25.76,30.94 25.76,31.87 IC6.16 | v26.67,19.51 26.52,19.36 25.91,19.36 IC7.16 | v19.66,40.84 21.79,42.98 21.79,48.16 23.16,49.53 R21.1
  Bottom 0.152: 18.24,27.94 v18.85,28.55 19.66,29.36 v19.66,40.84 | v17.12,27.58 17.86,28.32 18.24,27.94 | 18.24,27.94 v26.67,19.51

### Text on the board
tNames: GND|+5V | C1-C2-C3-C4-G-G | POL-1 | CIRC-POL | POL-2 | C1 - circ pol / C2 - lin pol | C3 - Pol-1 / C4 - Pol-2 | km5es / Pol Switch (mid-band)